# Altium schematic sheet ИТКС.687281.099Э3.SchDoc
size 420 x 297 mm; SheetNumber: 1; SheetTotal: 1
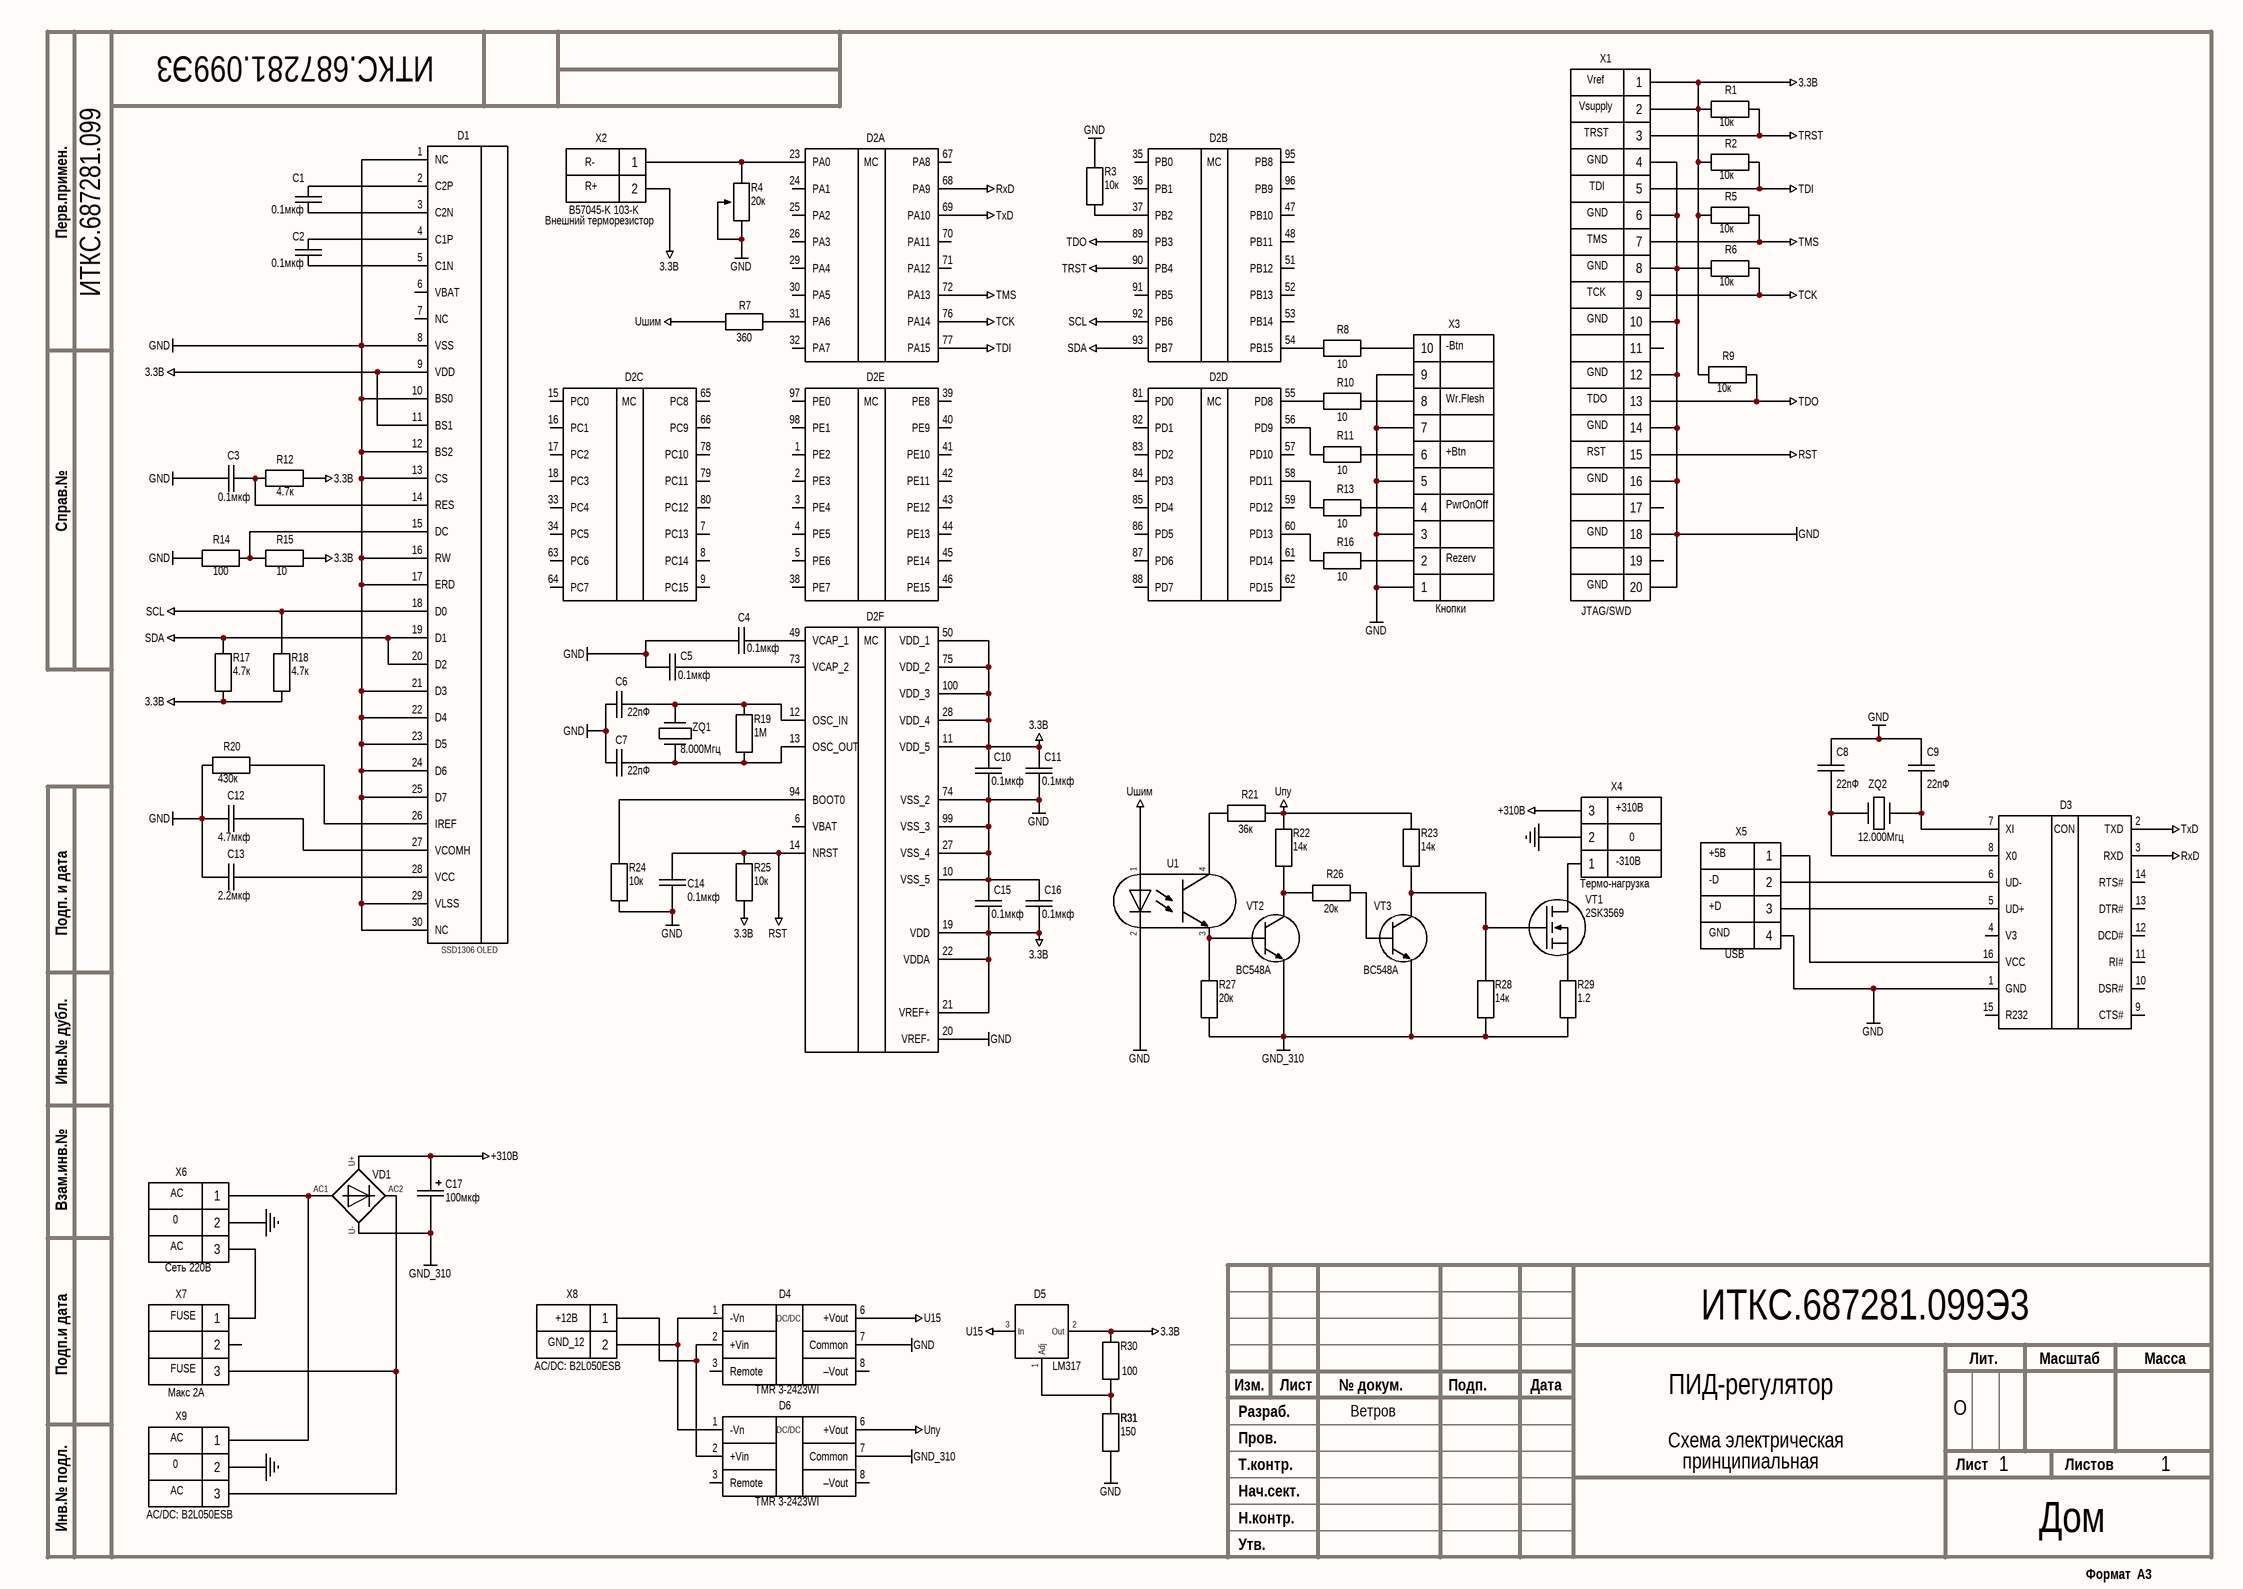
[diagram p0: ИТКС.687281.099Э3.SchDoc]

## Parts
C1  0.1мкф  [C 0805]
C2  0.1мкф  [C 0805]
C3  0.1мкф  [C 0805]
C4  0.1мкф  [C 0805]
C5  0.1мкф  [C 0805]
C6  22пФ  [C 0805]
C7  22пФ  [C 0805]
C8  22пФ  [C 0805]
C9  22пФ  [C 0805]
C10  0.1мкф  [C 0805]
C11  0.1мкф  [C 0805]
C12  4.7мкф  [C 0805]
C13  2.2мкф  [C 1210]
C14  0.1мкф  [C 0805]
C15  0.1мкф  [C 0805]
C16  0.1мкф  [C 0805]
C17  100мкф  [KSE-100]
D1  SSD1306 OLED  [50A-40BX]
D2  0  [LQFP - 100]  (value not drawn)  (parts A,B,C,D,E,F of 6)
D3  CH340G  [SO16]  (value not drawn)
D4  TMR 3-2423WI  [TMR 3WI Series]
D5  LM317  [TO-220]
D6  TMR 3-2423WI  [TMR 3WI Series]
R1  10к  [R 0805]
R2  10к  [R 0805]
R3  10к  [R 0805]
R4  20к  [JBR-3266W]
R5  10к  [R 0805]
R6  10к  [R 0805]
R7  360  [R 0805]
R8  10  [R 0805]
R9  10к  [R 0805]
R10  10  [R 0805]
R11  10  [R 0805]
R12  4.7к  [R 0805]
R13  10  [R 0805]
R14  100  [R 0805]
R15  10  [R 0805]
R16  10  [R 0805]
R17  4.7к  [R 0805]
R18  4.7к  [R 0805]
R19  1М  [R 0805]
R20  430к  [R 0805]
R21  36к  [R 0805]
R22  14к  [R 0805]
R23  14к  [R 0805]
R24  10к  [R 0805]
R25  10к  [R 0805]
R26  20к  [R 0805]
R27  20к  [R 0805]
R28  14к  [R 0805]
R29  1.2  [RX27-1]
R30  100  [R 0805]
R31  150  [R 0805]
U1  SFH618A-4X  [DIP4]  (value not drawn)
VD1  0  [BR-10]  (value not drawn)
VT1  2SK3569  [TO-220]
VT2  BC548A  [TO-92]
VT3  BC548A  [TO-92]
X1  JTAG/SWD  [BH-20R (DS1013-20R) (IDC-20MR)]
X2  B57045-K 103-K  [PLS-2]
X3  Кнопки  [PLS-10]
X4  Термо-нагрузка  [1-1123723-3]
X5  USB  [PLS-4]
X6  Сеть 220В  [1-1123723-3]
X7  Макс 2А  [1-1123723-3]
X8  AC/DC: B2L050ESB  [PLS-2]
X9  AC/DC: B2L050ESB  [1-1123723-3]
ZQ1  8.000Мгц  [HC-49S]
ZQ2  12.000Мгц  [HC-49S]

## Nets
3.3В: C10.1 C11.1 C15.2 C16.2 D1.9(VDD) D1.11(BS1) D2.11(VDD_5) D2.19(VDD) D2.21(VREF+) D2.22(VDDA) D2.28(VDD_4) D2.50(VDD_1) D2.75(VDD_2) D2.100(VDD_3) D5.2(Out) R1.1 R2.1 R5.1 R9.1 R12.2 R15.2 R17.1 R18.1 R25.1 R30.2 X1.1 X1.2 X2.2
+310В: C17.1 VD1.U+ X4.3
GND: C3.2 C4.2 C5.2 C6.1 C7.1 C8.2 C9.2 C10.2 C11.2 C12.1 C13.1 C14.2 C15.1 C16.1 D1.1(NC) D1.8(VSS) D1.10(BS0) D1.12(BS2) D1.13(CS) D1.16(RW) D1.17(ERD) D1.21(D3) D1.22(D4) D1.23(D5) D1.24(D6) D1.25(D7) D1.29(VLSS) D1.30(NC) D2.10(VSS_5) D2.20(VREF-) D2.27(VSS_4) D2.74(VSS_2) D2.99(VSS_3) D3.1(GND) D4.7(Common) R3.2 R4.1 R4.3 R6.1 R14.1 R20.1 R24.1 R31.1 U1.2(C) X1.4 X1.6 X1.8 X1.10 X1.12 X1.14 X1.16 X1.18 X1.20 X3.1 X3.3 X3.5 X3.7 X3.9 X5.4
GND_310: C17.2 D6.7(Common) R27.1 R28.1 R29.1 VD1.U- VT2.E VT3.E
GND_set: X4.2 X6.2 X9.2
RST: C14.1 D2.14(NRST) R25.2 X1.15
RxD: D2.68(PA9) D3.3(RXD)
SCL: D1.18(D0) D2.92(PB6) R18.2
SDA: D1.19(D1) D1.20(D2) D2.93(PB7) R17.2
TCK: D2.76(PA14) R6.2 X1.9
TDI: D2.77(PA15) R2.2 X1.5
TDO: D2.89(PB3) R9.2 X1.13
TMS: D2.72(PA13) R5.2 X1.7
TRST: D2.90(PB4) R1.2 X1.3
TxD: D2.69(PA10) D3.2(TXD)
U15: D4.6(+Vout) D5.3(In)
Uпу: D6.6(+Vout) R21.2 R22.2 R23.2
Uшим: R7.2 U1.1(A)
NetC1_1: C1.1 D1.3(C2N)
NetC1_2: C1.2 D1.2(C2P)
NetC2_1: C2.1 D1.5(C1N)
NetC2_2: C2.2 D1.4(C1P)
NetC3_1: C3.1 D1.14(RES) R12.1
NetC4_1: C4.1 D2.49(VCAP_1)
NetC5_1: C5.1 D2.73(VCAP_2)
NetC6_2: C6.2 D2.12(OSC_IN) R19.2 ZQ1.2
NetC7_2: C7.2 D2.13(OSC_OUT) R19.1 ZQ1.1
NetC8_1: C8.1 D3.8(X0) ZQ2.1
NetC9_1: C9.1 D3.7(XI) ZQ2.2
NetC12_2: C12.2 D1.27(VCOMH)
NetC13_2: C13.2 D1.28(VCC)
NetD1_15: D1.15(DC) R14.2 R15.1
NetD1_26: D1.26(IREF) R20.2
NetD2_23: D2.23(PA0) R4.2 X2.1
NetD2_31: D2.31(PA6) R7.1
NetD2_37: D2.37(PB2) R3.1
NetD2_54: D2.54(PB15) R8.1
NetD2_55: D2.55(PD8) R10.1
NetD2_56: D2.56(PD9) R11.1
NetD2_58: D2.58(PD11) R13.1
NetD2_60: D2.60(PD13) R16.1
NetD2_94: D2.94(BOOT0) R24.2
NetD3_5: D3.5(UD+) X5.3
NetD3_6: D3.6(UD-) X5.2
NetD3_16: D3.16(VCC) X5.1
NetD4_1: D4.1(-Vn) D6.1(-Vn) X8.2
NetD4_2: D4.2(+Vin) D6.2(+Vin) X8.1
NetD5_1: D5.1(Adj) R30.1 R31.2
NetR8_2: R8.2 X3.10
NetR10_2: R10.2 X3.8
NetR11_2: R11.2 X3.6
NetR13_2: R13.2 X3.4
NetR16_2: R16.2 X3.2
NetR21_1: R21.1 U1.4(C)
NetR22_1: R22.1 R26.2 VT2.K
NetR23_1: R23.1 R28.2 VT1.1(Gate) VT3.K
NetR26_1: R26.1 VT3.B
NetR27_2: R27.2 U1.3(E) VT2.B
NetR29_2: R29.2 VT1.3(Source)
NetVD1_AC1: VD1.AC1 X6.1 X9.1
NetVD1_AC2: VD1.AC2 X7.3 X9.3
NetVT1_2: VT1.2(Drain) X4.1
NetX6_3: X6.3 X7.1

Not connected (* = marked no-connect by the designer): D1 6(VBAT) 7(NC); D2 1(PE2) 2(PE3) 3(PE4) 4(PE5) 5(PE6) 6(VBAT) 7(PC13) 8(PC14) 9(PC15) 15(PC0) 16(PC1) 17(PC2) 18(PC3) 24(PA1) 25(PA2) 26(PA3) 29(PA4) 30(PA5) 32(PA7) 33(PC4) 34(PC5) 35(PB0) 36(PB1) 38(PE7) 39(PE8) 40(PE9) 41(PE10) 42(PE11) 43(PE12) 44(PE13) 45(PE14) 46(PE15) 47(PB10) 48(PB11) 51(PB12) 52(PB13) 53(PB14) 57(PD10) 59(PD12) 61(PD14) 62(PD15) 63(PC6) 64(PC7) 65(PC8) 66(PC9) 67(PA8) 70(PA11) 71(PA12) 78(PC10) 79(PC11) 80(PC12) 81(PD0) 82(PD1) 83(PD2) 84(PD3) 85(PD4) 86(PD5) 87(PD6) 88(PD7) 91(PB5) 95(PB8) 96(PB9) 97(PE0) 98(PE1); D3 4(V3) 9(CTS#) 10(DSR#) 11(RI#) 12(DCD#) 13(DTR#) 14(RTS#) 15(R232); D4 3(Remote) 8(–Vout); D6 3(Remote) 8(–Vout); X1 11 17 19; X7 2

## Notes on the sheet
- ИТКС.687281.099Э3
- (near X1) Vsupply
- (near X1) Vref
- (near X2) R-
- (near X2) R+
- (near X1) TRST
- (near X1) GND
- (near X1) TDI
- ИТКС.687281.099
- (near X2) Внешний терморезистор
- (near X1) TMS
- (near X1) TCK
- (near X3) -Btn
- (near X3) Wr.Flesh
- (near X3) +Btn
- (near X1) TDO
- (near X1) RST
- (near X3) PwrOnOff
- (near X3) Rezerv
- (near X4) -310В
- (near X4) +310В
- (near X4) 0
- (near X5) +5В
- -D
- +D
- (near X5) GND
- (near X6) AC
- (near X6) 0
- (near X7) FUSE
- (near X8) +12В
- (near X8) GND_12
- ПИД-регулятор
- (near X9) AC
- (near X9) 0
- Ветров
- принципиальная
- Схема электрическая
- О
- 1
- Дом
- Перв.примен.
- Справ.№
- Подп. и дата
- Инв.№ дубл.
- Взам.инв.№
- Подп.и дата
- Разраб.
- Изм.
- Лист
- № докум.
- Подп.
- Дата
- Лит.
- Масштаб
- Масса
- Т.контр.
- Пров.
- Листов
- Инв.№ подл.
- Утв.
- Н.контр.
- Нач.сект.
- Формат  A3
- (in symbol CH340G) CON
- (in symbol STM32F407VE6, part A) MC
- (in symbol STM32F407VE6, part B) MC
- (in symbol STM32F407VE6, part C) MC
- (in symbol STM32F407VE6, part D) MC
- (in symbol STM32F407VE6, part E) MC
- (in symbol STM32F407VE6, part F) MC
- (in symbol TMR 3-2423WI) DC/DC

## Library data of the parts
C1-C5 C10 C11 C14-C16 = GRM21BR71H 104: 0.1 мкФ X7R 50В 10% 0805, GRM21BR71H104KA01L
C6-C9 = GRM21A5C2E 220: 22пФ C0G 250B 5% 0805, GRM21A5C2E220J
C12 = GRM21BR61A 475: GRM21BR61A475KA73L, (чип 0805 X5R 4.7uF +10% 10V), Керамический ЧИП-конденсатор 0805 X5R 4.7мкФ +10%
C13 = GRM32ER72A 225: 2.2 мкФ X7R 10% 100В 1210, GRM32ER72A225K
C17 = KSE-100UF-400V-1830-105: Конденсатор электролитический KSE-100UF-400V-1830-105
D2 = STM32F407VE6: STM32F407VE6, Cortex-M3, 512k
D3 = CH340G: CH340G, Преобразователь интерфейса USB в UART [SOP-16]
D5 = LM317: LM317, Стабилизатор напряжения, линейный,регулируемый, 1,5А, TO220
R1-R3 R5 R6 R9 R24 R25 = RT0805BRD07 10K: 0.125Вт 0805 10 кОм, 0п.1%, RT0805BRD0710KL
R4 = JBR-3266W 203: JBR-3266W-203-R, 20 кОм, Резистор подстроечный
R7 = RC0805FR-07 360R: RC0805FR-07360RL, (чип 0805 360 1%), Толстопленочный ЧИП-резистор 0805 360Ом +1% 0.125Вт
R8 R10 R11 R13 R15 R16 = RC0805FR-07 10R: 0.125Вт 0805 10 Ом, 1%, RC0805FR-0710RL
R12 R17 R18 = RC0805FR07 4K7: 0.125Вт 0805 4.7 кОм, 1%, RC0805FR-074K7L
R14 R30 = RC0805FR-07 100R: 0.125Вт 0805 100 Ом, 1%, RC0805FR-07100RL
R19 = RC0805FR-07 1M: 0.125Вт 0805 1 МОм, 1%, RC0805FR-071ML
R20 = RC0805JR-07 430K: 0.125Вт 0805 430 кОм, 5%, RC0805JR-07430KL
R21 = RC0805FR-07 36K: RC0805FR-0736KL, (чип 0805 36.0К 1%), Толстопленочный ЧИП-резистор 0805 36кОм
R22 R23 R28 = RC0805FR-07 14K: 14 кОм 0805 1% RC0805FR-0714K
R26 R27 = RC0805FR-07 20K: 0.125Вт 0805 20 кОм, 1%, RC0805FR-0720KL
R29 = RX27-1 1.2R: RX27-1 1.2 Ом 5W 5% / SQP5, Мощный постоянный резистор , керамо-цементный корпус
R31 = RC0805FR-07 150R: RC0805FR-07150RL, (чип 0805 150 1%), Толстопленочный ЧИП-резистор 0805 150Ом +1% 0.125Вт
U1 = SFH618A-4X: SFH618A-4X, Оптопара транзисторная [DIP-4]
VD1 = BR1001: BR1001, Диодный мост однофазный 10А 100В [BR-10.] (=KBPC1001, BR101)
VT1 = 2SK3569: 2SK3569, Транзистор, TT-MOSVI, N-канал, 600В, 10А
VT2 VT3 = BC548A: BC548A, Транзистор NPN 30В 0.1А
X1 = BH-20R: BH-20R (DS1013-20R) (IDC-20MR), Вилка на плату угловая 20pin 2.54мм
X2 X8 = PLS-2: PLS-2 (DS-1021-1x2), Вилка штыревая 2.54мм 1x2pin прямая тип1
X3 = PLS-10: PLS-10(DS-1021-1x10), Вилка штыревая 2.54мм 1x10pin прямая тип1
X4 X6 X7 X9 = 1-1123723-3: 1-1123723-3 (B3P-VH), Разъем 3 pin шаг 3.96мм
X5 = PLS-4: PLS-4 (DS-1021-1x4), Вилка штыревая 2.54мм 1x4pin прямая тип1
ZQ1 = HC-49S 8M: 8.000Мгц, HC-49S, Кварцевый резонатор
ZQ2 = HC-49S 12M: 12.000Мгц, HC-49S, Кварцевый резонатор